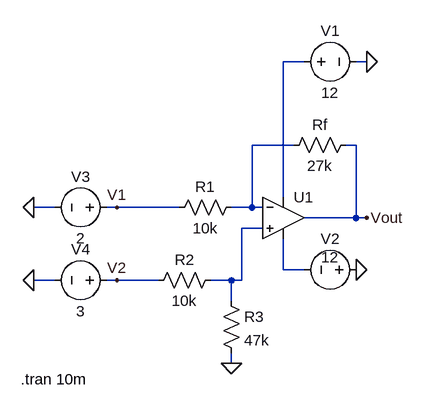
[diagram p0: schematic superposition-2.asc]
superposition-2.asc, the LTspice schematic file:
Version 4
SHEET 1 880 680
WIRE 240 -80 208 -80
WIRE 336 -80 320 -80
WIRE 224 48 160 48
WIRE 320 48 304 48
WIRE 208 128 208 -80
WIRE -144 144 -176 144
WIRE -48 144 -64 144
WIRE 48 144 -48 144
WIRE 160 144 160 48
WIRE 160 144 128 144
WIRE 176 144 160 144
WIRE 320 160 320 48
WIRE 320 160 240 160
WIRE 336 160 320 160
WIRE 176 176 144 176
WIRE 208 240 208 192
WIRE 240 240 208 240
WIRE -144 256 -176 256
WIRE -48 256 -64 256
WIRE 16 256 -48 256
WIRE 128 256 96 256
WIRE 144 256 144 176
WIRE 144 256 128 256
WIRE 128 288 128 256
WIRE 128 384 128 368
FLAG 320 240 0
FLAG 336 -80 0
FLAG 336 160 Vout
FLAG -176 144 0
FLAG 128 384 0
FLAG -176 256 0
FLAG -48 144 V1
FLAG -48 256 V2
SYMBOL voltage 336 240 R90
WINDOW 0 -32 56 VBottom 2
WINDOW 3 -4 56 VBottom 2
WINDOW 123 0 0 Left 0
WINDOW 39 0 0 Left 0
SYMATTR InstName V2
SYMATTR Value 12
SYMBOL res 144 128 R90
WINDOW 0 0 56 VBottom 2
WINDOW 3 32 56 VTop 2
SYMATTR InstName R1
SYMATTR Value 10k
SYMBOL OpAmps\\UniversalOpamp 208 160 R0
SYMATTR InstName U1
SYMBOL res 320 32 R90
WINDOW 0 0 56 VBottom 2
WINDOW 3 32 56 VTop 2
SYMATTR InstName Rf
SYMATTR Value 27k
SYMBOL voltage 224 -80 R270
WINDOW 0 32 56 VTop 2
WINDOW 3 -32 56 VBottom 2
WINDOW 123 0 0 Left 0
WINDOW 39 0 0 Left 0
SYMATTR InstName V1
SYMATTR Value 12
SYMBOL voltage -48 144 R90
WINDOW 0 -32 56 VBottom 2
WINDOW 3 32 56 VTop 2
WINDOW 123 0 0 Left 0
WINDOW 39 0 0 Left 0
SYMATTR InstName V3
SYMATTR Value 2
SYMBOL res 112 272 R0
SYMATTR InstName R3
SYMATTR Value 47k
SYMBOL res 112 240 R90
WINDOW 0 0 56 VBottom 2
WINDOW 3 32 56 VTop 2
SYMATTR InstName R2
SYMATTR Value 10k
SYMBOL voltage -48 256 R90
WINDOW 0 -32 56 VBottom 2
WINDOW 3 32 56 VTop 2
WINDOW 123 0 0 Left 0
WINDOW 39 0 0 Left 0
SYMATTR InstName V4
SYMATTR Value 3
TEXT -196 408 Left 2 !.tran 10m

The netlist it stands for:
* superposition-2.asc
V2 0 N004 12
R1 N002 V1 10k
XU1 N003 N002 N001 N004 Vout level1 Avol=1Meg GBW=10Meg Vos=0 En=0 Enk=0 In=0 Ink=0 Rin=500Meg  ; pins In+ In- V+ V- OUT
Rf Vout N002 27k
V1 N001 0 12
V3 V1 0 2
R3 N003 0 47k
R2 N003 V2 10k
V4 V2 0 3
.tran 10m
.lib UniversalOpAmp1.lib
.backanno
.end